# Altium schematic sheet analog_in.SchDoc: foxBMS BMS-Slave 12-Cell
size A3; DocumentNumber: 7; SheetNumber: 7; SheetTotal: 15; AUTHOR: Fraunhofer IISB foxBMS Team; SheetDescription: Primary Analog Inputs
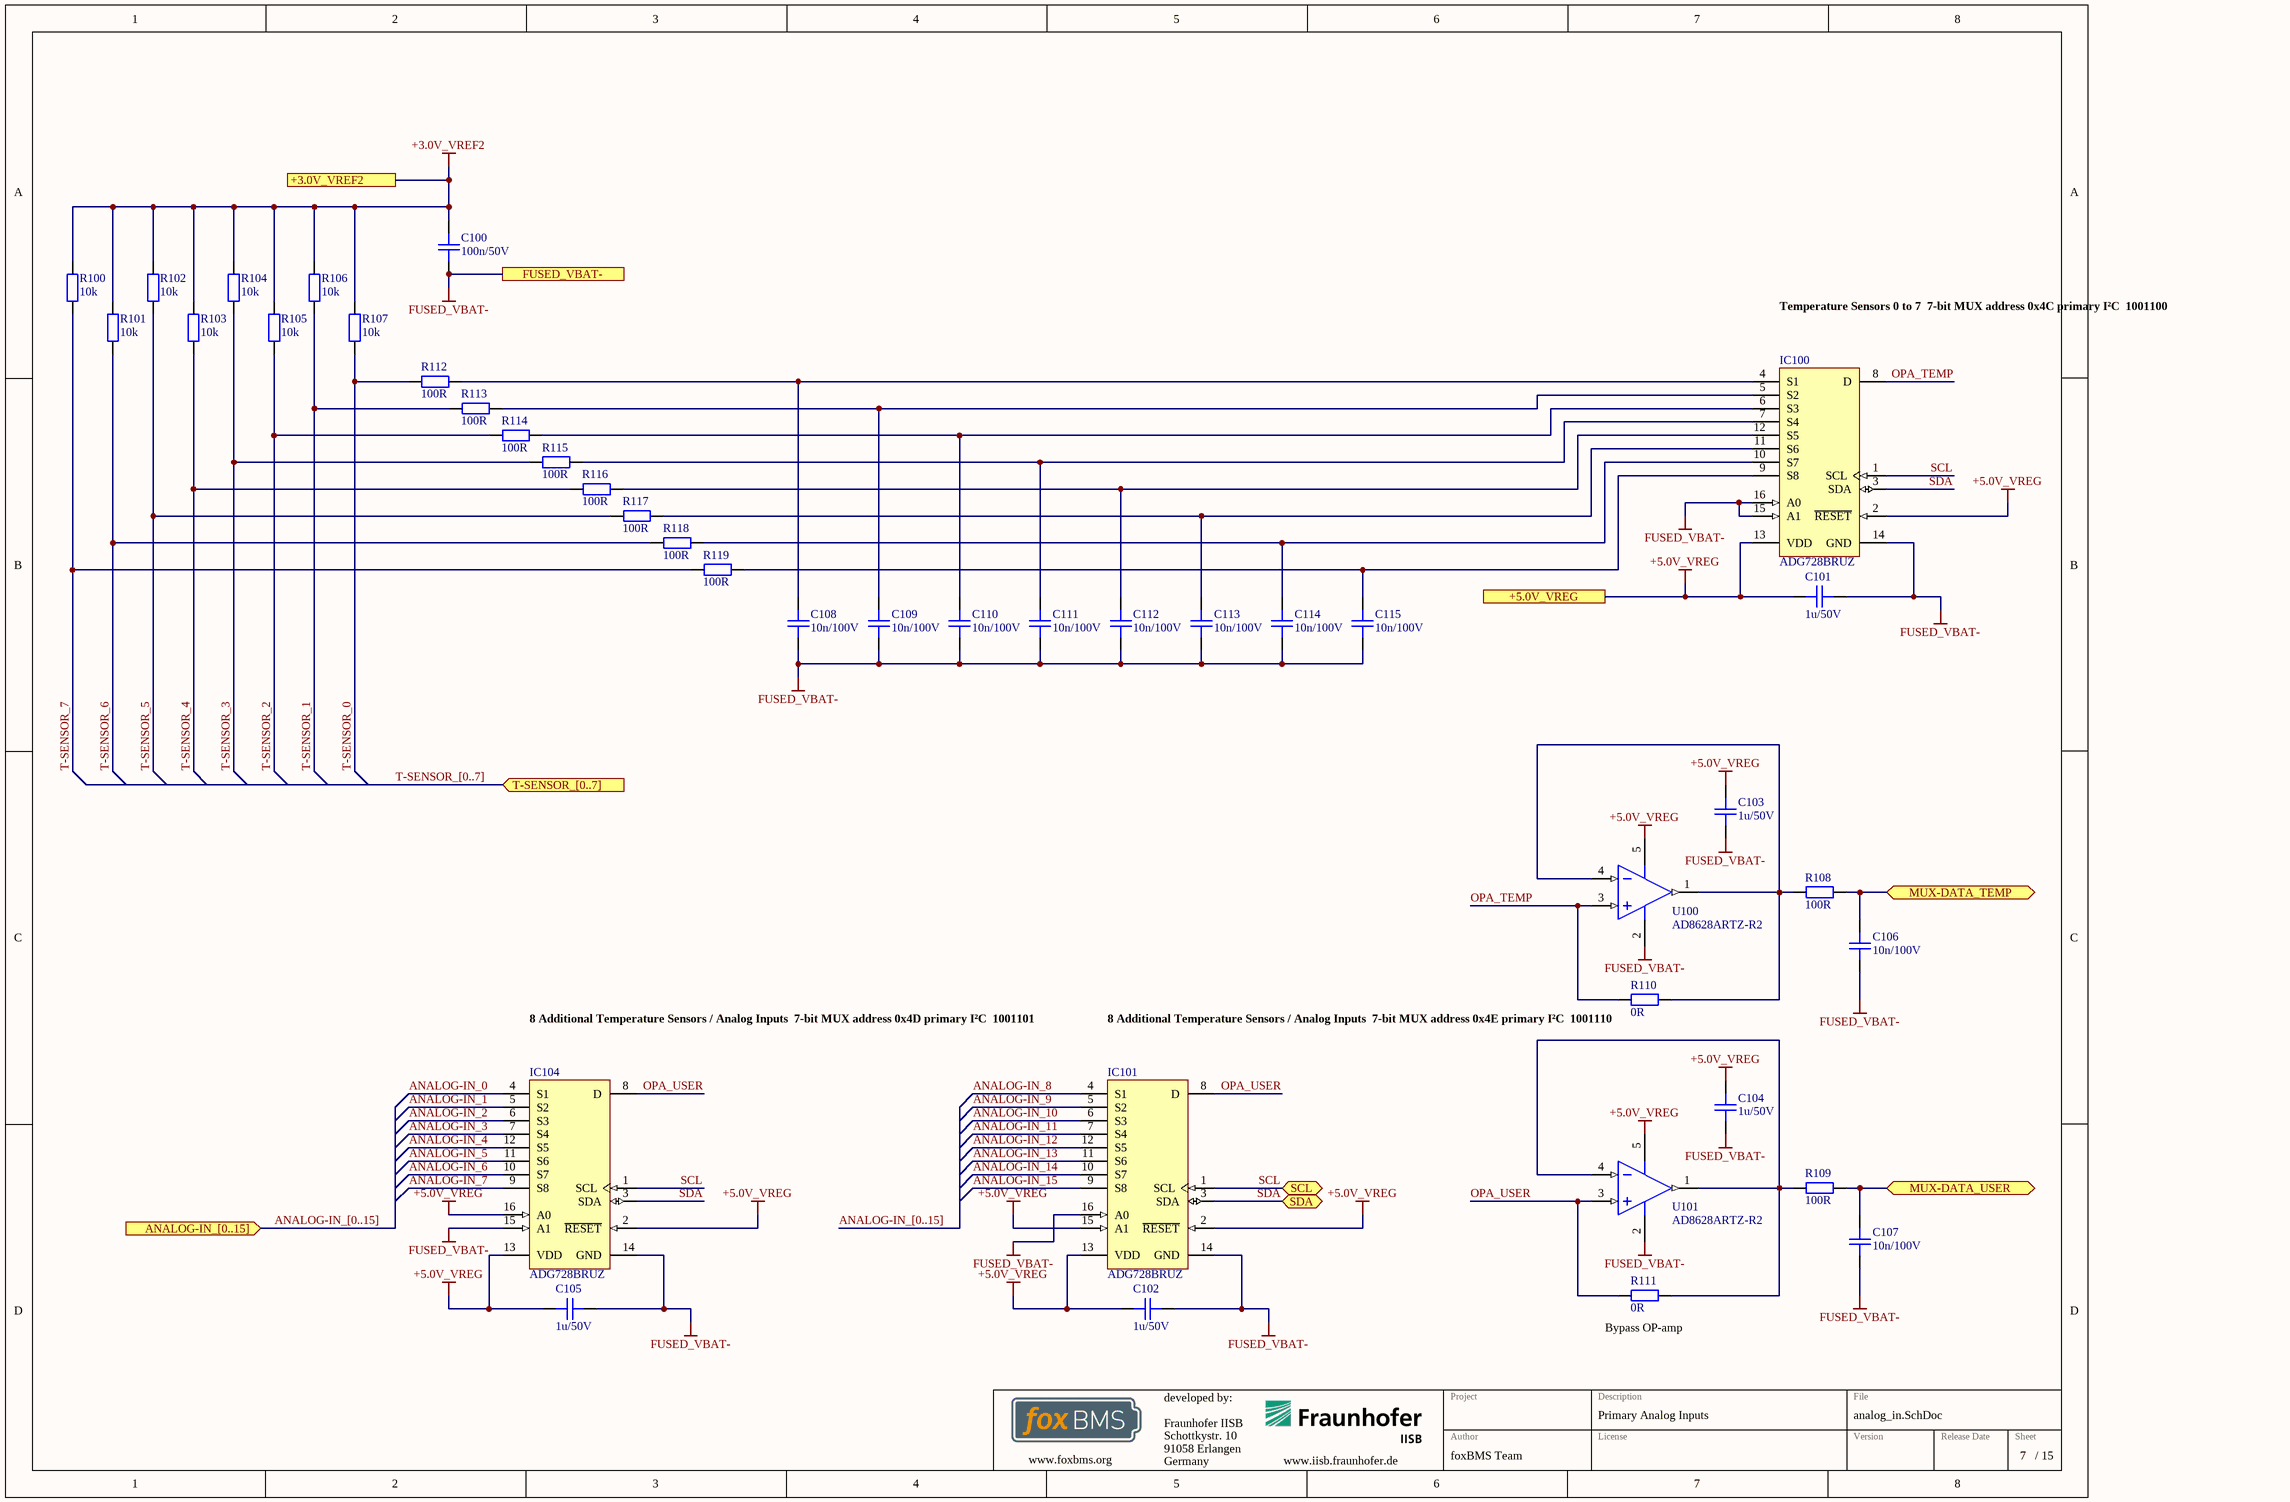
[diagram p0: analog_in.SchDoc]

## Parts
C100  100n/50V  [CAPC1608X08N]
C101  1u/50V  [CAPC2012X14N]
C102  1u/50V  [CAPC2012X14N]
C103  1u/50V  [CAPC2012X14N]
C104  1u/50V  [CAPC2012X14N]
C105  1u/50V  [CAPC2012X14N]
C106  10n/100V  [CAPC1608X08N]
C107  10n/100V  [CAPC1608X08N]
C108  10n/100V  [CAPC1608X08N]
C109  10n/100V  [CAPC1608X08N]
C110  10n/100V  [CAPC1608X08N]
C111  10n/100V  [CAPC1608X08N]
C112  10n/100V  [CAPC1608X08N]
C113  10n/100V  [CAPC1608X08N]
C114  10n/100V  [CAPC1608X08N]
C115  10n/100V  [CAPC1608X08N]
IC100  ADG728BRUZ  [ADI-RU-16_M]
IC101  ADG728BRUZ  [ADI-RU-16_M]
IC104  ADG728BRUZ  [ADI-RU-16_M]
R100  10k  [RESC1608X05N]
R101  10k  [RESC1608X05N]
R102  10k  [RESC1608X05N]
R103  10k  [RESC1608X05N]
R104  10k  [RESC1608X05N]
R105  10k  [RESC1608X05N]
R106  10k  [RESC1608X05N]
R107  10k  [RESC1608X05N]
R108  100R  [RESC1608X05N]
R109  100R  [RESC1608X05N]
R110  0R  [RESC1608X05N]
R111  0R  [RESC1608X05N]
R112  100R  [RESC1608X05N]
R113  100R  [RESC1608X05N]
R114  100R  [RESC1608X05N]
R115  100R  [RESC1608X05N]
R116  100R  [RESC1608X05N]
R117  100R  [RESC1608X05N]
R118  100R  [RESC1608X05N]
R119  100R  [RESC1608X05N]
U100  AD8628ARTZ-R2  [ADI-RJ-5_M]
U101  AD8628ARTZ-R2  [ADI-RJ-5_M]

## Ports
+3.0V_VREF2, +5.0V_VREG, ANALOG-IN_[0..15] (in), FUSED_VBAT-, MUX-DATA_TEMP (bidir), MUX-DATA_USER (bidir), SCL (bidir), SDA (bidir), T-SENSOR_[0..7] (in)

## Nets
+3.0V_VREF2: C100.2 R100.2 R101.2 R102.2 R103.2 R104.2 R105.2 R106.2 R107.2 ; port +3.0V_VREF2
+5.0V_VREG: C101.2 C102.2 C103.2 C104.2 C105.2 IC100.2(~{RESET}) IC100.13(VDD) IC101.2(~{RESET}) IC101.13(VDD) IC101.15(A1) IC104.2(~{RESET}) IC104.13(VDD) IC104.16(A0) U100.5(+V) U101.5(+V) ; port +5.0V_VREG
FUSED_VBAT-: C100.1 C101.1 C102.1 C103.1 C104.1 C105.1 C106.1 C107.1 C108.1 C109.1 C110.1 C111.1 C112.1 C113.1 C114.1 C115.1 IC100.14(GND) IC100.15(A1) IC100.16(A0) IC101.14(GND) IC101.16(A0) IC104.14(GND) IC104.15(A1) U100.2(-V) U101.2(-V) ; port FUSED_VBAT-
ANALOG-IN_0: IC104.4(S1)
ANALOG-IN_1: IC104.5(S2)
ANALOG-IN_2: IC104.6(S3)
ANALOG-IN_3: IC104.7(S4)
ANALOG-IN_4: IC104.12(S5)
ANALOG-IN_5: IC104.11(S6)
ANALOG-IN_6: IC104.10(S7)
ANALOG-IN_7: IC104.9(S8)
ANALOG-IN_8: IC101.4(S1)
ANALOG-IN_9: IC101.5(S2)
ANALOG-IN_10: IC101.6(S3)
ANALOG-IN_11: IC101.7(S4)
ANALOG-IN_12: IC101.12(S5)
ANALOG-IN_13: IC101.11(S6)
ANALOG-IN_14: IC101.10(S7)
ANALOG-IN_15: IC101.9(S8)
MUX-DATA_TEMP: C106.2 R108.2 ; port MUX-DATA_TEMP
MUX-DATA_USER: C107.2 R109.2 ; port MUX-DATA_USER
OPA_TEMP: IC100.8(D) R110.1 U100.3(+IN)
OPA_USER: IC101.8(D) IC104.8(D) R111.1 U101.3(+IN)
SCL: IC100.1(SCL) IC101.1(SCL) IC104.1(SCL) ; port SCL
SDA: IC100.3(SDA) IC101.3(SDA) IC104.3(SDA) ; port SDA
T-SENSOR_0: R107.1 R112.2
T-SENSOR_1: R106.1 R113.2
T-SENSOR_2: R105.1 R114.2
T-SENSOR_3: R104.1 R115.2
T-SENSOR_4: R103.1 R116.2
T-SENSOR_5: R102.1 R117.2
T-SENSOR_6: R101.1 R118.2
T-SENSOR_7: R100.1 R119.2
NetC108_2: C108.2 IC100.4(S1) R112.1
NetC109_2: C109.2 IC100.5(S2) R113.1
NetC110_2: C110.2 IC100.6(S3) R114.1
NetC111_2: C111.2 IC100.7(S4) R115.1
NetC112_2: C112.2 IC100.12(S5) R116.1
NetC113_2: C113.2 IC100.11(S6) R117.1
NetC114_2: C114.2 IC100.10(S7) R118.1
NetC115_2: C115.2 IC100.9(S8) R119.1
NetR108_1: R108.1 R110.2 U100.1(OUT) U100.4(-IN)
NetR109_1: R109.1 R111.2 U101.1(OUT) U101.4(-IN)

## Buses and harness runs
bus ANALOG-IN_[0..15]
bus ANALOG-IN_[0..15] = port ANALOG-IN_[0..15]
bus T-SENSOR_[0..7] = port T-SENSOR_[0..7]

## Notes on the sheet
- Temperature Sensors 0 to 7
  7-bit MUX address 0x4C primary I²C
  1001100
- 8 Additional Temperature Sensors / Analog Inputs
  7-bit MUX address 0x4D primary I²C
  1001101
- (near R110) 8 Additional Temperature Sensors / Analog Inputs
  7-bit MUX address 0x4E primary I²C
  1001110
- (near R111) Bypass OP-amp
- Fraunhofer IISB
- Schottkystr. 10
- developed by:
- 91058 Erlangen
- Germany
- Author
- Project
- License
- Description
- File
- Version
- Release Date
- Sheet
- www.foxbms.org
- www.iisb.fraunhofer.de
- foxBMS Team
- /

## Library data of the parts
C100 = gen_C_ceramic_100n_50V_X7R_0603: MLCC; Capacitance: 100n; Rated Voltage: 50V; Dielectric: X7R; Case EIA: 0603; Case Metric: 1608; PnP Package: C_0603_10; PnP Value: 100n/50V/X7R; PnP equipped: x; Automotive Qualified: True; Part Number: gen_C_ceramic_100n_50V_X7R_0603; Supplier 1: Farnell; Supplier Part Number 1: 2525267; Supplier 2: Digikey; Supplier Part Number 2: 490-6049-1-ND; Supplier 3: Farnell; Supplier Part Number 3: 2070398
C101-C105 = gen_C_ceramic_1u_50V_X7R_0805: MLCC; Capacitance: 1u; Rated Voltage: 50V; Dielectric: X7R; Case EIA: 0805; Case Metric: 2012; Automotive Qualified: True; Tolerance: ± 10%; AVT Set: x; Part Number: gen_C_ceramic_1u_50V_X7R_0805; Supplier 1: Farnell; Supplier Part Number 1: 2672199; Operating Temperature: -55°C - +125°C; Supplier 2: Farnell; Supplier Part Number 2: 2479894; Supplier 3: Farnell; Supplier Part Number 3: 2464630
C106-C115 = gen_C_ceramic_10n_100V_X7R_0603: MLCC; Capacitance: 10n; Rated Voltage: 100V; Dielectric: X7R; Case EIA: 0603; Case Metric: 1608; Automotive Qualified: True; Part Number: gen_C_ceramic_10n_100V_X7R_0603; Supplier 1: Farnell; Supplier Part Number 1: 1301715; Supplier 2: Farnell; Supplier Part Number 2: 2821192; Supplier 3: Farnell; Supplier Part Number 3: 2210878
IC100 IC101 IC104 = CMP-0798-00197-1: CMOS, Low Voltage, 2-Wire Serially Controlled, Matrix Switch, -40 to 85 degC, 16-pin SOP (RU-16), Tube; Manufacturer: Analog Devices; Ron (ohms): 2.5; Supply V Guar Performance: Single_(+3V), Single_(+5V); Max Analog Signal Range: 0 to Vdd; Bandwidth (Hz): 65M; ComponentLink3Description: Package Specification; Packing: Tube; PartNumber: ADG728BRUZ; ComponentLink1URL: http://www.analog.com/en/index.html; Mounting Technology: Surface Mount; DatasheetVersion: Rev. C; ComponentLink1Description: Manufacturer URL; ComponentLink3URL: http:/www.analog.com/static/imported-files/packages/36244347913743854010197452789RU16.pdf; ComponentLink2URL: http://www.analog.com/static/imported-files/data_sheets/ADG728_729.pdf; PackageVersion: Nov-02; PackageDescription: 16-Pin Thin Shrink Small Outline Package, Body 5 x 4.4 mm, Pitch 0.65 mm; Code_JEDEC: MO-153AB; PackageReference: RU-16; ComponentLink2Description: Datasheet
R100-R107 = gen_R_10k_0603: SMD Resistor 10k 0603; Tolerance: 1%; Power: 0.1W; Case EIA: 0603; Case Metric: 1608; Maximum Working Voltage: 75V; PnP Package: R_0603; Automotive Qualified: True; Part Number: gen_R_10k_0603; Operating Temperature: -55°C - +155°C; Resistance: 10k; Series: E24, E96; PnP Value: 10k; Supplier 1: Farnell; Supplier Part Number 1: 2073349
R108 R109 R112-R119 = gen_R_100R_0603: SMD Resistor 100R 0603; Tolerance: 1%; Power: 0.1W; Case EIA: 0603; Case Metric: 1608; Maximum Working Voltage: 75V; PnP Package: R_0603; Automotive Qualified: True; Part Number: gen_R_100R_0603; Operating Temperature: -55°C - +155°C; Resistance: 100R; Series: E24, E96; PnP Value: 100R; Supplier 1: Digikey; Supplier Part Number 1: P100HCT-ND
R110 R111 = gen_R_0R_0603: SMD Resistor 0R 0603; Power: 0.1W; Case EIA: 0603; Case Metric: 1608; Maximum Working Voltage: 75V; PnP Package: R_0603; Automotive Qualified: True; Part Number: gen_R_0R_0603; Operating Temperature: -55°C - +155°C; Resistance: 0R; Series: Jumper; PnP Value: 0R; Supplier 1: Farnell; Supplier Part Number 1: 2616580
U100 U101 = CMP-0384-01512-2: Single Channel RRIO Operational Amplifier, 2.5 MHz BW, 1 V/us SR, Industrial, 5-pin SOT23 (RJ-5), Reel; Manufacturer: Analog Devices; Generic Part Number: AD8628; Iq/Amp: 1.1mA; Automotive Qualified: Yes; V Span Max: 6V; Input Bias Current: 30pA; Slew Rate: 1V/us; Amplifiers Per Package: 1; Input Offset Voltage: 1uV; Small Signal Bandwidth: 2.5MHz; V Span Min: 2.7V; ComponentLink1Description: Manufacturer URL; DatasheetVersion: Rev. I; ComponentLink4Description: Reference Circuit; Code_JEDEC: MO-178-AA; PackageDescription: 5-Pin Small Outline Transistor Package, Body 2.9 x 1.6 mm, Pitch 0.95 mm; ComponentLink3URL: http://www.analog.com/static/imported-files/packages/PKG_PDF/SOT-23(RJ)/RJ_5.pdf; PackageReference: RJ-5; ComponentLink1URL: http://www.analog.com/en/index.html; PackageVersion: 121608-A; RevisionNote: Reference Circuit URL fixed; Mounting Technology: Surface Mount; ComponentLink2Description: Datasheet; ComponentLink3Description: Package Specification; ComponentLink4URL: http://www.analog.com/en/all-operational-amplifiers-op-amps/operational-amplifiers-op-amps/ad8628/products/product.html#product-recommendations; ComponentLink2URL: http://www.analog.com/static/imported-files/data_sheets/AD8628_8629_8630.pdf; PartNumber: AD8628ARTZ-R2